# EAGLE board MaTouch ESP32-P4 TFT with Touch 7“ V1.2 (EAGLE 6.1), part 1 of 2
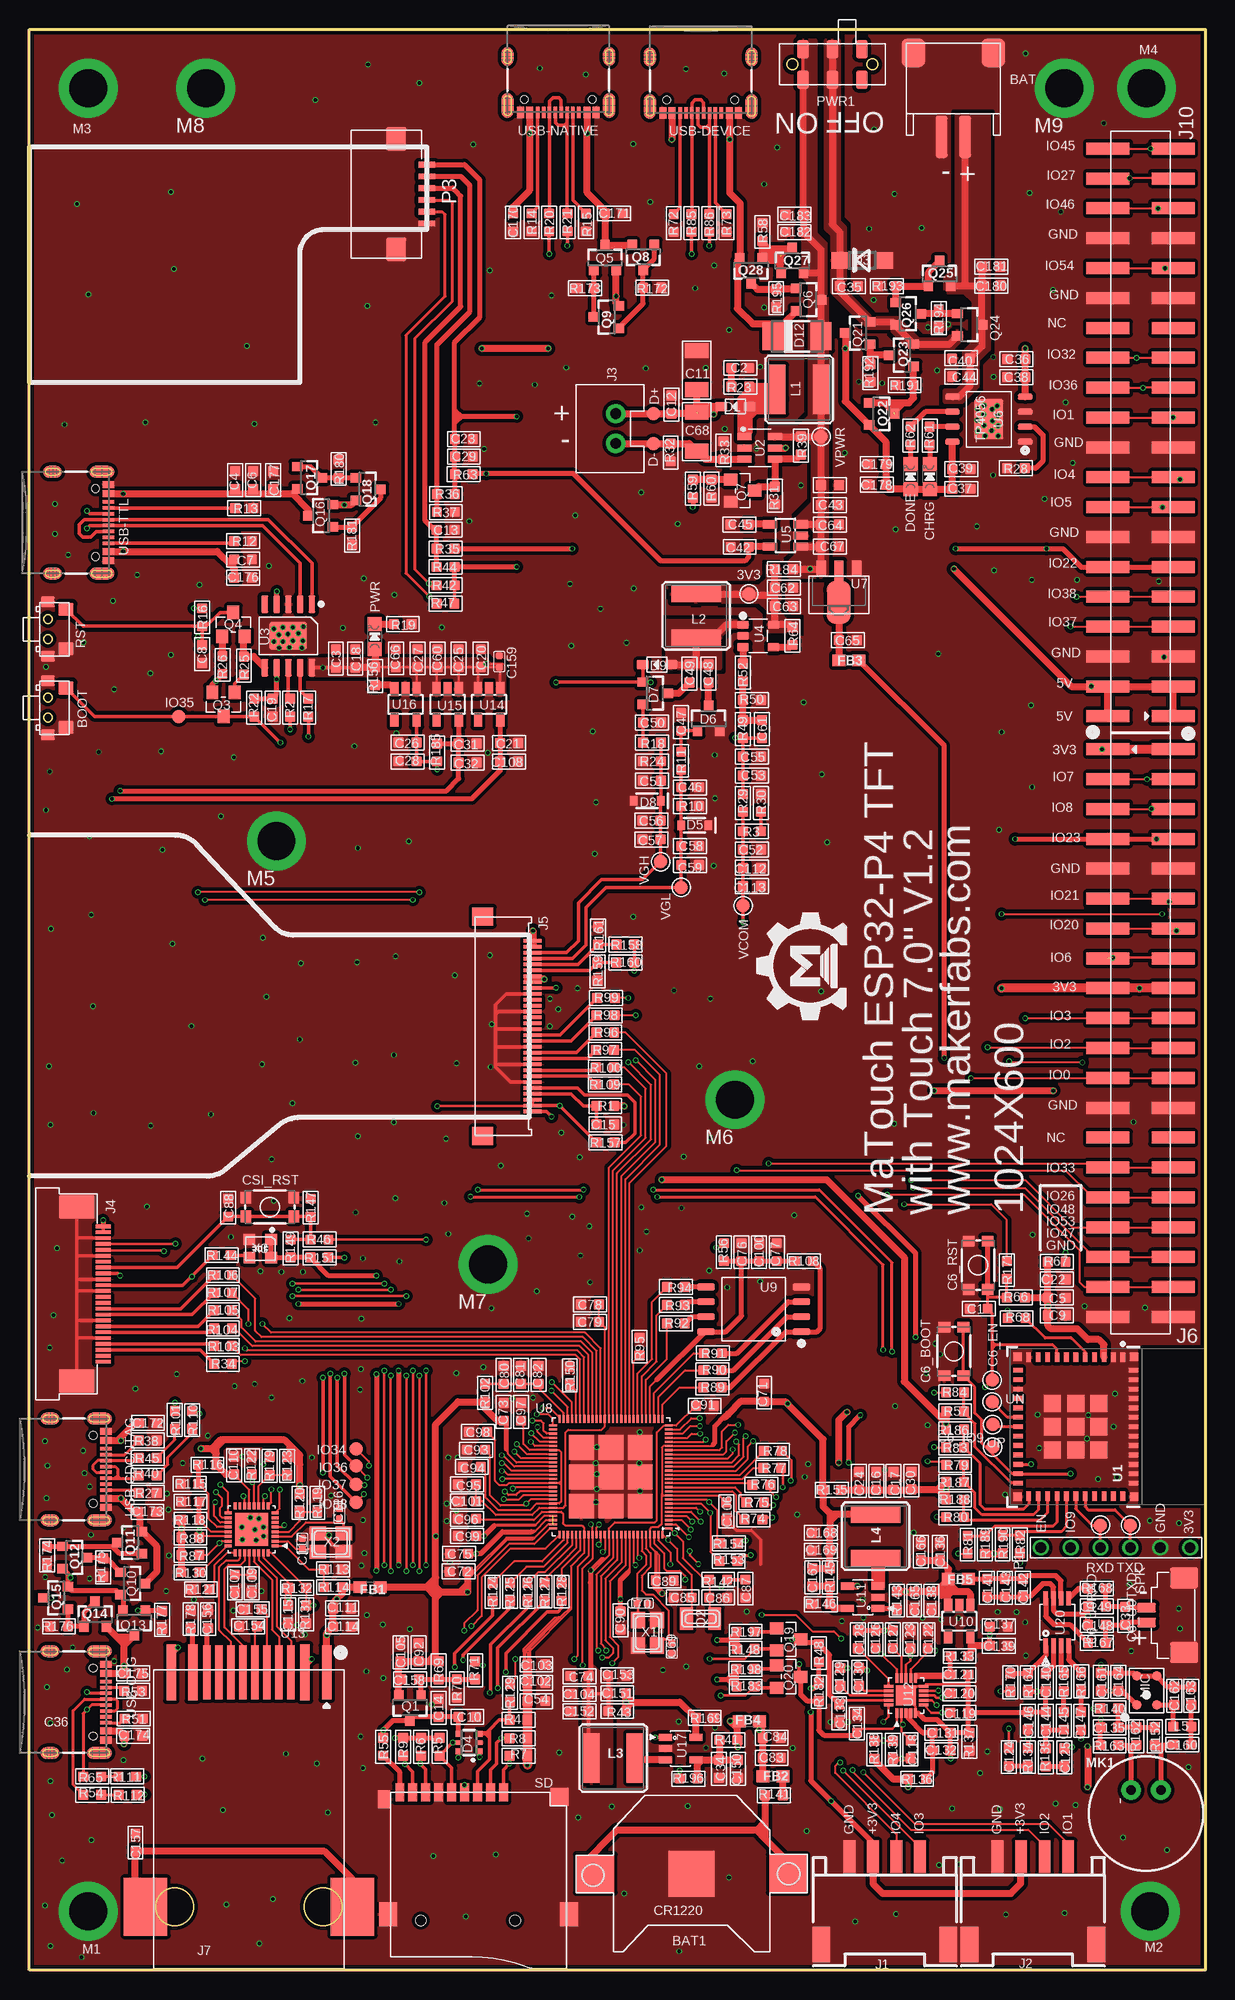
[diagram p5: board, top side]
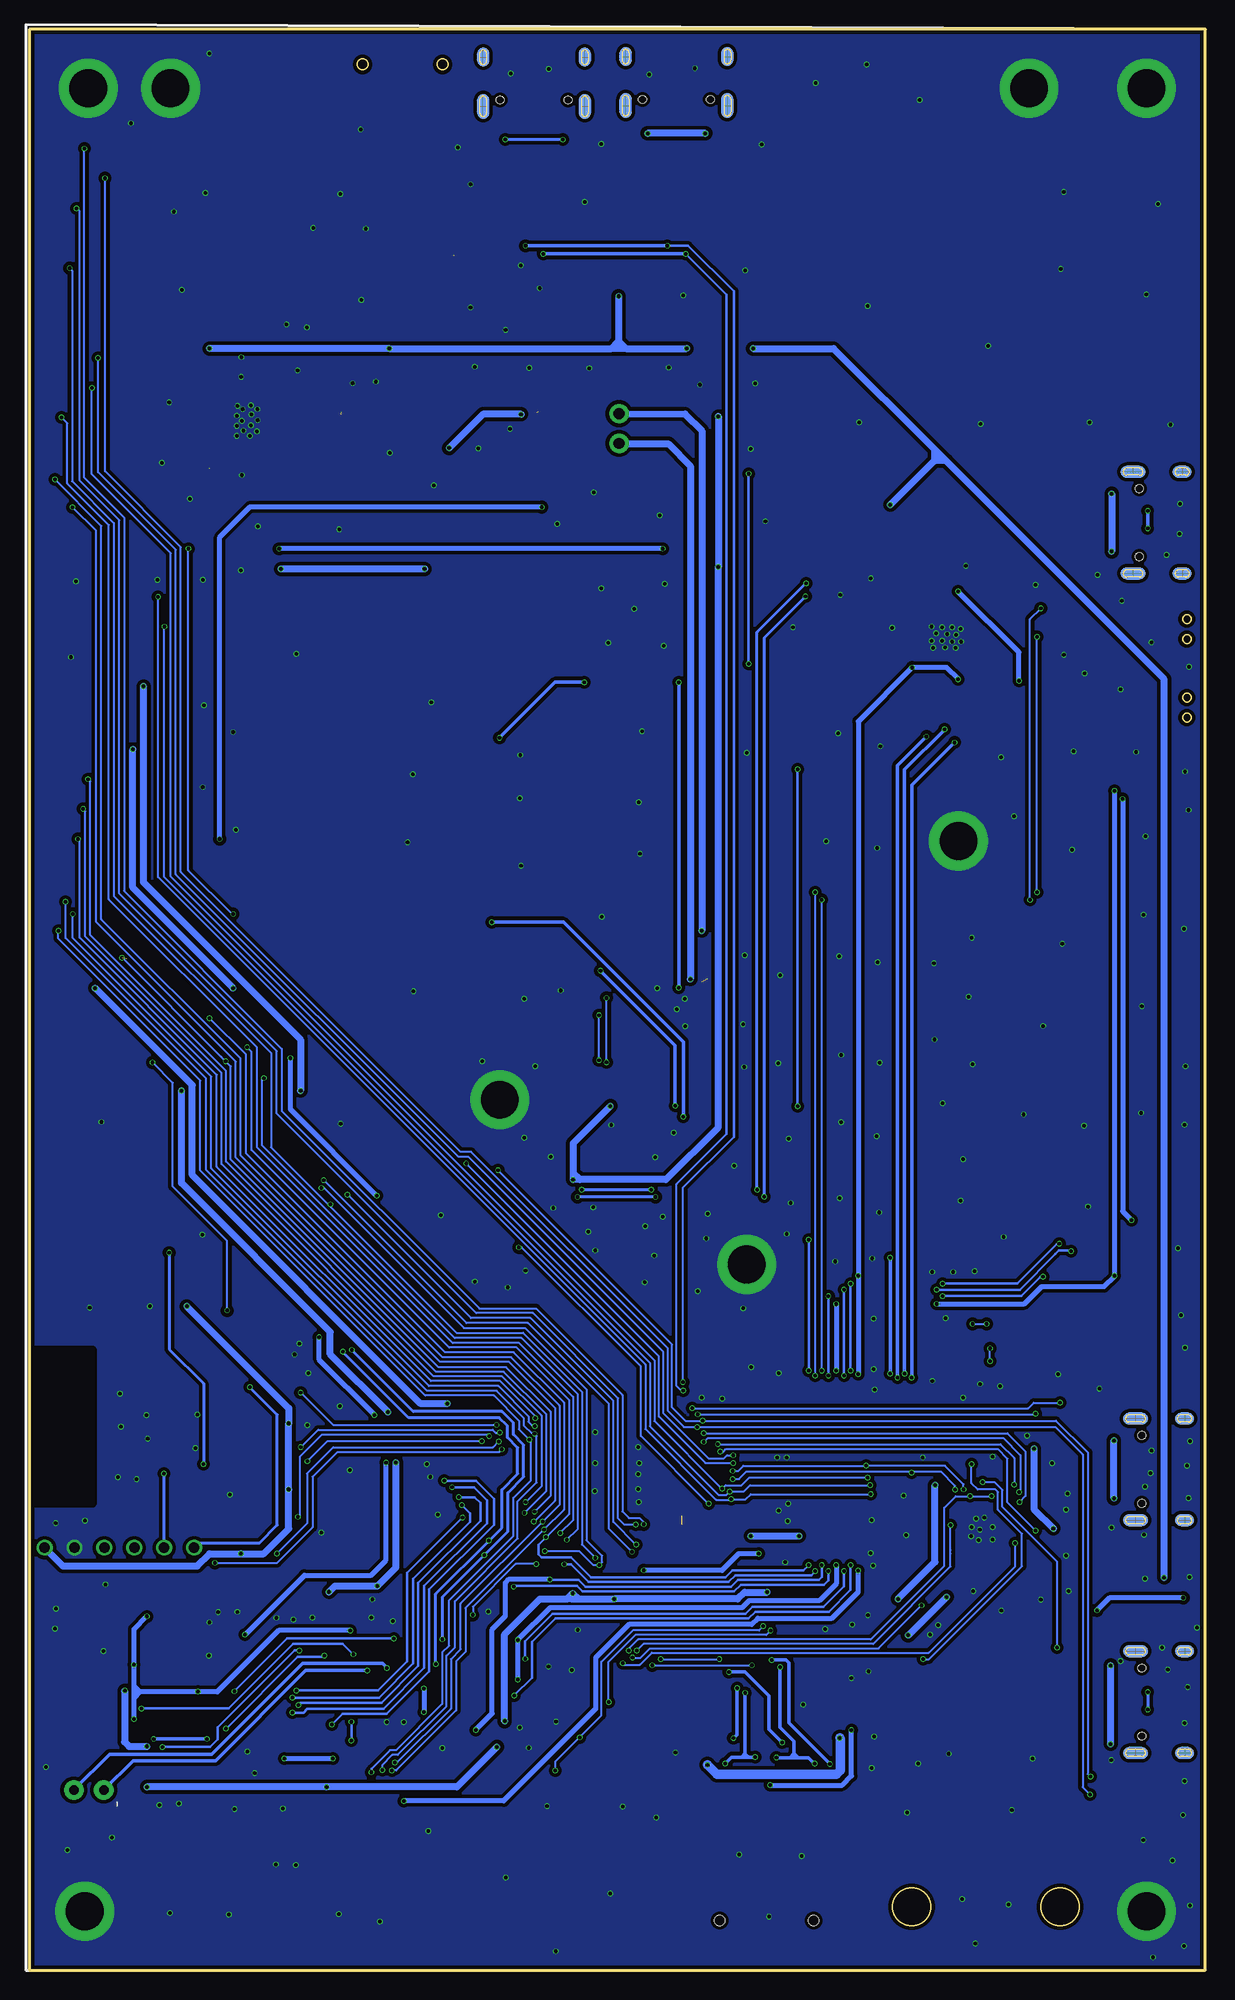
[diagram p6: board, bottom side, seen from below]

Size 100 x 165 mm. Coordinates in mm from the lower left corner, seen from the top.
Outline: 0,0 0,165 100,165 100,0 0,0
Copper layers (1*16): Top 0.035mm / dielectric 1.5mm / Bottom 0.035mm
Design rules: minimum track width 7mil, minimum drill 10mil, track to track 6mil, track to pad 6mil, pad to pad 6mil, via to via 6mil, smd to smd 0mil, copper to edge 6mil, drill to drill 6mil, minimum pad ring 3mil, minimum via ring 3mil, stop-mask expansion 2mil, vias tented up to drill 100mil, thermal gap 0mil
Net classes: 0 default: width 0.152 mm, drill 0.305 mm, clearance 0.152 mm; 1 vbat: drill 0.305 mm

## Footprints (pad centres in the part's own frame; a part is rotated, then mirrored left to right if it is on the bottom)
TP_4545 = smd 1.143 x 1.143: T 0,0
HW2-SMD-2.0-90D = smd 2 x 2.4: 3 3.4,-2.181; 4 -3.4,-2.181 | smd 1 x 3.6: + -1,4.953; - 1,4.953
CR1220-SMD = smd 3.2 x 3.2: +$1 -8.2,0; +$2 8.2,0 | smd 3.9 x 3.9: - 0,0
2*4*3.5MM = smd 1.15 x 1.3: 1 -1.675,0; 2 1.675,0 | smd 0.9 x 1.2: 3 2.3,1.55; 4 -2.3,1.55
C0603 = smd 0.889 x 0.889: 1 -0.762,0; 2 0.762,0
DISCRETE_C0603 = smd 0.889 x 0.889: 1 -0.762,0; 2 0.762,0
TACTILE_SWITCH_SMD_4.6X2.8MM = smd 0.9 x 1: 1 -2.05,-0.8; 2 2.05,-0.8; 3 2.05,0.8; 4 -2.05,0.8
DISCRETE_C1206 = smd 1.27 x 2.032: 1 -1.651,0; 2 1.651,0
DISCRETE_C0402 = smd 0.635 x 0.635: 1 -0.445,0; 2 0.445,0
C0402 = smd 0.635 x 0.635: 1 0,0.484; 2 0,-0.484
C0603' = smd 0.889 x 0.889: 1 0,0.762; 2 0,-0.762
CHIPLED_0805_NOOUTLINE = smd 1.2 x 1.2: A 0,-1.05; C 0,1.05
SOD323 = smd 1 x 0.8: + -1.2,0; - 1.2,0
SOD123 = smd 1.4 x 1.4: A 1.9,0; C -1.9,0
SOT363 = smd 0.5 x 0.5: 1 -0.75,-0.9; 3 0.75,-0.9; 4 0.75,0.9; 6 -0.75,0.9 | smd 0.4 x 0.5: 2 0,-0.9; 5 0,0.9
SOD-323 = smd 0.63 x 0.83: A 1.15,0; C -1.15,0
SOT23-3 = smd 0.8 x 0.9: 1 -0.95,-1; 2 0.95,-1; 3 0,1.1
DO-214AC = smd 1.8 x 2.4: A 2.025,0; C -2.025,0
TP-D45MIL = smd 1.143 x 1.143: T 0,0
0603 = smd 1.1 x 1: 1 -0.85,0; 2 0.85,0
HW4-SMD-2.0-90D = smd 1.01 x 2.74: 1 -3,-0.1; 2 -1,-0.1; 3 1,-0.1; 4 3,-0.1 | smd 1.5 x 3: SS1 -5.4,7.4; SS2 5.4,7.4
XH2.54-2P = drill 0.9 pad 1.651: 1 -1.27,0; 2 1.27,0
SMD26-50P-1760L450W = smd 0.3 x 1.3: 1 5.75,0; 2 5.25,0; 3 4.75,0; 4 4.25,0; 5 3.75,0; 6 3.25,0; 7 2.75,0; 8 2.25,0; 9 1.75,0; 10 1.25,0; 11 0.75,0; 12 0.25,0; 13 -0.25,0; 14 -0.75,0; 15 -1.25,0; 16 -1.75,0; 17 -2.25,0; 18 -2.75,0; 19 -3.25,0; 20 -3.75,0; 21 -4.25,0; 22 -4.75,0; 23 -5.25,0; 24 -5.75,0 | smd 2 x 3: 25 -7.4,-2.25; 26 7.4,-2.25
30P-0.5-90D-18.4X5.0 = smd 0.305 x 1.524: 1 7.25,2; 2 6.75,2; 3 6.25,2; 4 5.75,2; 5 5.25,2; 6 4.75,2; 7 4.25,2; 8 3.75,2; 9 3.25,2; 10 2.75,2; 11 2.25,2; 12 1.75,2; 13 1.25,2; 14 0.75,2; 15 0.25,2; 16 -0.25,2; 17 -0.75,2; 18 -1.25,2; 19 -1.75,2; 20 -2.25,2; 21 -2.75,2; 22 -3.25,2; 23 -3.75,2; 24 -4.25,2; 25 -4.75,2; 26 -5.25,2; 27 -5.75,2; 28 -6.25,2; 29 -6.75,2; 30 -7.25,2 | smd 1.524 x 1.778: P$1 -9.33,-2.25; P$2 9.33,-2.25
SMD2X20-254P-5080L750W920H = smd 1.02 x 3.65: 1 -24.13,-2.775; 2 -24.13,2.775; 3 -21.59,-2.775; 4 -21.59,2.775; 5 -19.05,-2.775; 6 -19.05,2.775; 7 -16.51,-2.775; 8 -16.51,2.775; 9 -13.97,-2.775; 10 -13.97,2.775; 11 -11.43,-2.775; 12 -11.43,2.775; 13 -8.89,-2.775; 14 -8.89,2.775; 15 -6.35,-2.775; 16 -6.35,2.775; 17 -3.81,-2.775; 18 -3.81,2.775; 19 -1.27,-2.775; 20 -1.27,2.775; 21 1.27,-2.775; 22 1.27,2.775; 23 3.81,-2.775; 24 3.81,2.775; 25 6.35,-2.775; 26 6.35,2.775; 27 8.89,-2.775; 28 8.89,2.775; 29 11.43,-2.775; 30 11.43,2.775; 31 13.97,-2.775; 32 13.97,2.775; 33 16.51,-2.775; 34 16.51,2.775; 35 19.05,-2.775; 36 19.05,2.775; 37 21.59,-2.775; 38 21.59,2.775; 39 24.13,-2.775; 40 24.13,2.775
HR961160C = smd 0.81 x 4.6: 1 -6.61,-9.961 | smd 0.81 x 4.77: 2 -4.77,-9.961; 11 4.77,-9.961; 12 6.61,-9.961 | smd 0.61 x 4.6: 3 -3.57,-9.961; 4 -2.55,-9.961; 5 -1.53,-9.961; 6 -0.51,-9.961; 7 0.51,-9.961; 8 1.53,-9.961; 9 2.55,-9.961; 10 3.57,-9.961 | smd 3.7 x 4.9: 13 8.799,9.961; 14 -8.799,9.961
CR54 = smd 4.2 x 1.4: P$1 0,1.85; P$2 0,-1.85
L0603 = smd 0.889 x 0.889: 1 -0.762,0; 2 0.762,0
M2.5 = drill 3.2 pad 5: 1 0,0
MIC4-SMD-3.76X2.95MM = smd 0.8 x 0.8: 1 0.85,1.23; 2 0.85,-1.23; 3 -0.85,-1.23; 4 -0.85,1.23
MICROPHONE-PTH-9.7MM = drill 0.8 pad 1.676: 1 -2,1.27; 2 -2,-1.27
DEBUG*6 = drill 0.9: 1 0,0; 2 0,2.54; 3 0,5.08; 4 0,7.62; 5 0,10.16; 6 0,12.7
1*6P-SMT1MM = smd 0.5 x 1.5: 1 -2.5,0; 2 -1.5,0; 3 -0.5,0; 4 0.5,0; 5 1.5,0; 6 2.5,0 | smd 2 x 1.7: 7 4.7,-2.6; 8 -4.7,-2.6
SMD-6-2.5MM = smd 1 x 1.6: 1 -2.5,1.3; 1@1 -2.5,-1.3; 2 0,1.3; 2@1 0,-1.3; 3 2.5,1.3; 3@1 2.5,-1.3
XTAL3215 = smd 1.1 x 1.9: P$1 1.2,0; P$2 -1.2,0
SOT23 = smd 1.016 x 1.143: 1 -0.95,-1.016; 2 0.95,-1.016; 3 0,1.016
DISCRETE_R0603 = smd 0.889 x 0.889: 1 -0.762,0; 2 0.762,0
R0603 = smd 0.889 x 0.889: 1 -0.762,0; 2 0.762,0
9P-SMD-W/-RING = smd 1.524 x 0.762: 1 0,4.4; 2 0,3.3; 3 0,2.2; 4 0,1.1; 5 0,0; 6 0,-1.1; 7 0,-2.2; 8 0,-3.3; 9 0,-4.4 | smd 1.524 x 1.016: G1 0.6,-5.746 | smd 2.032 x 1.524: G2 10.373,-5.4; G3 10.373,10 | smd 1.524 x 1.524: G4 0.392,9.181 | hole 0.889: 10.9,-2.6; 10.9,5.4
1X2P-SMT1.25MM = smd 0.8 x 1.6: 1 -0.625,0; 2 0.625,0 | smd 1.8 x 2.4: 3 3.175,-3.2; 4 -3.175,-3.2
ESP32-C6-MINI-1 = smd 0.8 x 0.4: 1 -5.9,4; 2 -5.9,3.2; 3 -5.9,2.4; 4 -5.9,1.6; 5 -5.9,0.8; 6 -5.9,0; 7 -5.9,-0.8; 8 -5.9,-1.6; 9 -5.9,-2.4; 10 -5.9,-3.2; 11 -5.9,-4; 25 5.9,-4; 26 5.9,-3.2; 27 5.9,-2.4; 28 5.9,-1.6; 29 5.9,-0.8; 30 5.9,0; 31 5.9,0.8; 32 5.9,1.6; 33 5.9,2.4; 34 5.9,3.2; 35 5.9,4 | smd 0.4 x 0.8: 12 -4.8,-4.9; 13 -4,-4.9; 14 -3.2,-4.9; 15 -2.4,-4.9; 16 -1.6,-4.9; 17 -0.8,-4.9; 18 0,-4.9; 19 0.8,-4.9; 20 1.6,-4.9; 21 2.4,-4.9; 22 3.2,-4.9; 23 4,-4.9; 24 4.8,-4.9; 36 4.8,4.9; 37 4,4.9; 38 3.2,4.9; 39 2.4,4.9; 40 1.6,4.9; 41 0.8,4.9; 42 0,4.9; 43 -0.8,4.9; 44 -1.6,4.9; 45 -2.4,4.9; 46 -3.2,4.9; 47 -4,4.9; 48 -4.8,4.9 | smd 1.45 x 1.45: 49.1 -1.975,1.975; 49.2 -1.975,0; 49.3 -1.975,-1.975; 49.4 0,-1.975; 49.5 1.975,-1.975; 49.6 1.975,0; 49.7 1.975,1.975; 49.8 0,1.975; 49.9 0,0 | smd 0.7 x 0.7: 50 5.95,4.95; 51 5.95,-4.95; 52 -5.95,-4.95; 53 -5.95,4.95
SOT23-6 = smd 1.2 x 0.6: 1 -1.3,0.95; 2 -1.3,0; 3 -1.3,-0.95; 4 1.3,-0.95; 5 1.3,0; 6 1.3,0.95
ESOP-10-EP-150MIL = smd 1.5 x 0.6: 1 -2.7,2; 2 -2.7,1; 3 -2.7,0; 4 -2.7,-1; 5 -2.7,-2; 6 2.7,-2; 7 2.7,-1; 8 2.7,0; 9 2.7,1; 10 2.7,2 | smd 2.4 x 3.2: EP 0,0
SOT-23-5 = smd 0.7 x 1: 1 -0.95,-1.3; 2 0,-1.3; 3 0.95,-1.3; 4 0.95,1.3; 5 -0.95,1.3
SOT23-5 = smd 0.69 x 1.2: 1 -0.95,-1.3; 2 0,-1.3; 3 0.95,-1.3; 4 0.95,1.3; 5 -0.95,1.3
SOP8-1.27P = smd 1.27 x 0.51: 1 -3.1,1.905; 2 -3.1,0.635; 3 -3.1,-0.635; 4 -3.1,-1.905; 5 3.1,-1.905; 6 3.1,-0.635; 7 3.1,0.635; 8 3.1,1.905 | smd 2.5 x 3.4: 9 0,0
SOT89 = smd 0.8 x 1.4: 1 -1.524,-1.905; 3 1.524,-1.905 | smd 0.8 x 1.9: 2 0,-1.651 | smd 2.032 x 3.65: 4 0,0.94
QFN105-35P-500L500W = smd 0.65 x 0.18: 1 -4.925,4.375; 2 -4.925,4.025; 3 -4.925,3.675; 4 -4.925,3.325; 5 -4.925,2.975; 6 -4.925,2.625; 7 -4.925,2.275; 8 -4.925,1.925; 9 -4.925,1.575; 10 -4.925,1.225; 11 -4.925,0.875; 12 -4.925,0.525; 13 -4.925,0.175; 14 -4.925,-0.175; 15 -4.925,-0.525; 16 -4.925,-0.875; 17 -4.925,-1.225; 18 -4.925,-1.575; 19 -4.925,-1.925; 20 -4.925,-2.275; 21 -4.925,-2.625; 22 -4.925,-2.975; 23 -4.925,-3.325; 24 -4.925,-3.675; 25 -4.925,-4.025; 26 -4.925,-4.375; 53 4.925,-4.375; 54 4.925,-4.025; 55 4.925,-3.675; 56 4.925,-3.325; 57 4.925,-2.975; 58 4.925,-2.625; 59 4.925,-2.275; 60 4.925,-1.925; 61 4.925,-1.575; 62 4.925,-1.225; 63 4.925,-0.875; 64 4.925,-0.525; 65 4.925,-0.175; 66 4.925,0.175; 67 4.925,0.525; 68 4.925,0.875; 69 4.925,1.225; 70 4.925,1.575; 71 4.925,1.925; 72 4.925,2.275; 73 4.925,2.625; 74 4.925,2.975; 75 4.925,3.325; 76 4.925,3.675; 77 4.925,4.025; 78 4.925,4.375 | smd 0.18 x 0.65: 27 -4.375,-4.925; 28 -4.025,-4.925; 29 -3.675,-4.925; 30 -3.325,-4.925; 31 -2.975,-4.925; 32 -2.625,-4.925; 33 -2.275,-4.925; 34 -1.925,-4.925; 35 -1.575,-4.925; 36 -1.225,-4.925; 37 -0.875,-4.925; 38 -0.525,-4.925; 39 -0.175,-4.925; 40 0.175,-4.925; 41 0.525,-4.925; 42 0.875,-4.925; 43 1.225,-4.925; 44 1.575,-4.925; 45 1.925,-4.925; 46 2.275,-4.925; 47 2.625,-4.925; 48 2.975,-4.925; 49 3.325,-4.925; 50 3.675,-4.925; 51 4.025,-4.925; 52 4.375,-4.925; 79 4.375,4.925; 80 4.025,4.925; 81 3.675,4.925; 82 3.325,4.925; 83 2.975,4.925; 84 2.625,4.925; 85 2.275,4.925; 86 1.925,4.925; 87 1.575,4.925; 88 1.225,4.925; 89 0.875,4.925; 90 0.525,4.925; 91 0.175,4.925; 92 -0.175,4.925; 93 -0.525,4.925; 94 -0.875,4.925; 95 -1.225,4.925; 96 -1.575,4.925; 97 -1.925,4.925; 98 -2.275,4.925; 99 -2.625,4.925; 100 -2.975,4.925; 101 -3.325,4.925; 102 -3.675,4.925; 103 -4.025,4.925; 104 -4.375,4.925 | smd 2.1 x 2.1: 105 0,0; 106 -2.5,0; 107 2.5,0; 108 2.5,2.5; 109 0,2.5; 110 -2.5,2.5; 111 -2.5,-2.5; 112 0,-2.5; 113 2.5,-2.5
SOIC-8-208MIL = smd 1.5 x 0.635: 1 -4.05,1.905; 2 -4.05,0.635; 3 -4.05,-0.635; 4 -4.05,-1.905; 5 4.05,-1.905; 6 4.05,-0.635; 7 4.05,0.635; 8 4.05,1.905
SOT23-5-95P-300L300W = smd 1.1 x 0.6: 1 -1.3,0.95; 2 -1.3,0; 3 -1.3,-0.95; 4 1.3,-0.95; 5 1.3,0.95
QFN20-40P-300L300W55H = smd 0.8 x 0.25: 1 -1.5,0.8; 2 -1.5,0.4; 3 -1.5,0; 4 -1.5,-0.4; 5 -1.5,-0.8; 11 1.5,-0.8; 12 1.5,-0.4; 13 1.5,0; 14 1.5,0.4; 15 1.5,0.8 | smd 0.25 x 0.8: 6 -0.8,-1.5; 7 -0.4,-1.5; 8 0,-1.5; 9 0.4,-1.5; 10 0.8,-1.5; 16 0.8,1.5; 17 0.4,1.5; 18 0,1.5; 19 -0.4,1.5; 20 -0.8,1.5 | smd 1.7 x 1.7: 21 0,0
QFN32-40P-400W400L = smd 0.6 x 0.25: 1 -2,1.4; 2 -2,1; 3 -2,0.6; 4 -2,0.2; 5 -2,-0.2; 6 -2,-0.6; 7 -2,-1; 8 -2,-1.4; 17 2,-1.4; 18 2,-1; 19 2,-0.6; 20 2,-0.2; 21 2,0.2; 22 2,0.6; 23 2,1; 24 2,1.4 | smd 0.25 x 0.6: 9 -1.4,-2; 10 -1,-2; 11 -0.6,-2; 12 -0.2,-2; 13 0.2,-2; 14 0.6,-2; 15 1,-2; 16 1.4,-2; 25 1.4,2; 26 1,2; 27 0.6,2; 28 0.2,2; 29 -0.2,2; 30 -0.6,2; 31 -1,2; 32 -1.4,2 | smd 2.8 x 2.8: 33 0,0
MSOP8-65P-490L300W110H = smd 1.2 x 0.38: 1 -2,0.975; 2 -2,0.325; 3 -2,-0.325; 4 -2,-0.975; 5 2,-0.975; 6 2,-0.325; 7 2,0.325; 8 2,0.975
USB-C-16P-5 = smd 0.3 x 1: A5 -1.25,-0.34; A6 -0.25,-0.34; A7 0.25,-0.34; A8 1.25,-0.34; B5 1.75,-0.34; B6 0.75,-0.34; B7 -0.75,-0.34; B8 -1.75,-0.34 | smd 0.6 x 1: GND -3.225,-0.34; GND2 3.225,-0.34; VBUS1 -2.45,-0.34; VBUS2 2.45,-0.34 | smd 1 x 2.1: SHLD1 -4.32,-0.915; SHLD2 4.32,-0.915 | smd 1 x 2.1 bottom: SHLD3 -4.32,-0.915; SHLD4 4.32,-0.915 | smd 1 x 1.6: SHLD5 -4.32,-5.095; SHLD8 4.32,-5.095 | smd 1 x 1.6 bottom: SHLD6 -4.32,-5.095; SHLD7 4.32,-5.095 | hole 0.65: -2.89,-1.445; 2.89,-1.445
NX3225 = smd 1.4 x 1.2: 1 -1.1,-0.8; 2 1.1,-0.8; 3 1.1,0.8; 4 -1.1,0.8
OSC4-SMD-2.5X2.0X0.8MM = smd 1 x 0.95: 1 -0.925,-0.775; 2 0.925,-0.775; 3 0.925,0.775; 4 -0.925,0.775

## Placement (x,y rotation side)
3V3  [TP_4545]  61.19,116.99 0 top
BAT  JST-2P  [HW2-SMD-2.0-90D]  78.56,160.82 180 top
BAT1  [CR1220-SMD]  56.31,8.2 180 top
BOOT  TS24CA  [2*4*3.5MM]  3.12,107.33 90 top
C1  1uF/16V  [C0603]  80.72,56.24 180 top
C2  10pF/50V  [DISCRETE_C0603]  60.45,136.22 180 top
C3  10uF  [DISCRETE_C0603]  26.06,111.51 270 top
C4  10uF  [DISCRETE_C0603]  17.5,126.67 270 top
C5  10uF  [C0603]  87.38,57.18 0 top
C6  10uF  [DISCRETE_C0603]  19.02,126.67 270 top
C6_BOOT  MOMENTARY-SWITCH-SPST-SMD-4.6X2.8MM  [TACTILE_SWITCH_SMD_4.6X2.8MM]  78.61,52.6 270 top
C6_EN  [TP_4545]  81.86,50.16 270 top
C6_IO9  [TP_4545]  81.92,44.48 270 top
C6_RST  MOMENTARY-SWITCH-SPST-SMD-4.6X2.8MM  [TACTILE_SWITCH_SMD_4.6X2.8MM]  80.67,59.92 270 top
C6_U0RXD  [TP_4545]  91.08,37.82 270 top
C6_U0TXD  [TP_4545]  93.62,37.82 270 top
C7  0.1uF  [DISCRETE_C0603]  18.16,119.94 180 top
C8  0.1uF  [DISCRETE_C0603]  14.68,111.89 90 top
C9  0.1uF  [C0603]  87.38,55.65 0 top
C10  10uF  [DISCRETE_C0603]  37.24,21.54 180 top
C11  4.7uF/35V  [DISCRETE_C1206]  56.74,136.02 270 top
C12  0.1uF/50V  [DISCRETE_C0603]  54.58,133.1 270 top
C13  NC  [DISCRETE_C0603]  35.38,122.45 180 top
C14  0.1uF  [DISCRETE_C0603]  34.8,22.3 270 top
C15  100nF  [DISCRETE_C0603]  48.97,71.91 180 top
C16  10uF  [DISCRETE_C0603]  72.01,41.61 270 top
C17  0.1uF  [DISCRETE_C0603]  73.48,41.61 270 top
C18  0.1uF  [DISCRETE_C0603]  27.71,111.51 270 top
C19  0.1uF  [DISCRETE_C0603]  20.68,107.34 90 top
C20  4.7uF/16V  [C0603]  38.38,111.53 90 top
C21  10uF  [C0603]  40.79,104.32 0 top
C22  10uF  [C0603]  87.37,58.71 0 top
C23  10uF  [DISCRETE_C0603]  36.94,130.16 180 top
C24  0.1uF  [DISCRETE_C0603]  70.53,41.61 270 top
C25  4.7uF/16V  [C0603]  36.5,111.53 90 top
C26  0.1uF  [DISCRETE_C0603]  32.16,104.37 0 top
C27  4.7uF/16V  [C0603]  32.99,111.53 90 top
C28  10uF  [C0603]  32.16,102.77 180 top
C29  10uF  [DISCRETE_C0603]  36.94,128.67 180 top
C30  0.1uF  [DISCRETE_C0603]  74.98,41.62 270 top
C31  10uF  [C0603]  37.26,104.29 0 top
C32  0.1uF  [DISCRETE_C0603]  37.26,102.67 180 top
C33  330pF/50V  [C0603]  93.19,30.12 90 top
C34  10uF  [C0603]  58.65,17.12 270 top
C35  10uF  [C0603]  69.7,143.18 180 top
C36  10uF  [C0603]  83.92,136.96 0 top
C37  0.1uF  [C0603]  79.25,125.93 0 top
C38  10uF  [C0603]  83.92,135.43 180 top
C39  0.1uF  [C0603]  79.25,127.61 0 top
C40  10uF  [C0603]  79.22,137.03 180 top
C41  4.7uF/16V  [C0603]  68.07,126.26 0 top
C42  10uF  [C0603]  60.4,121.01 180 top
C43  10uF  [C0603]  68.07,124.56 180 top
C44  0.1uF  [C0603]  79.22,135.48 180 top
C45  NC  [C0603]  60.38,122.91 180 top
C46  0.1uF  [DISCRETE_C0603]  56.18,100.56 180 top
C47  0.1uF  [DISCRETE_C0603]  55.42,106.12 270 top
C48  0.1uF  [DISCRETE_C0603]  57.76,110.24 270 top
C49  0.1uF  [DISCRETE_C0603]  56.13,110.24 90 top
C50  0.1uF  [DISCRETE_C0603]  52.93,106.07 180 top
C51  0.1uF  [DISCRETE_C0603]  52.93,101.14 0 top
C52  0.1uF  [DISCRETE_C0603]  61.44,95.28 180 top
C53  0.1uF  [DISCRETE_C0603]  61.44,101.57 180 top
C54  10uF  [DISCRETE_C0603]  43.11,22.87 180 top
C55  0.1uF  [DISCRETE_C0603]  61.44,103.17 180 top
C56  1uF  [DISCRETE_C0603]  52.91,97.74 0 top
C57  1uF  [DISCRETE_C0603]  52.91,96.14 0 top
C58  1uF  [DISCRETE_C0603]  56.18,95.58 180 top
C59  1uF  [DISCRETE_C0603]  56.18,93.95 180 top
C60  0.1uF  [DISCRETE_C0603]  34.7,111.53 270 top
C61  10pF/25V  [DISCRETE_C0603]  62.28,105.51 270 top
C62  0.1uF  [DISCRETE_C0603]  64.16,117.55 180 top
C63  10uF  [DISCRETE_C0603]  64.16,115.98 180 top
C64  4.7uF/16V  [C0603]  68.07,122.91 0 top
C65  10uF  [C0603]  69.6,113.08 0 top
C66  0.1uF  [DISCRETE_C0603]  31.17,111.53 270 top
C67  0.1uF  [C0603]  68.07,121.03 180 top
C68  NC  [DISCRETE_C1206]  56.74,130.81 90 top
C69  12pF  [DISCRETE_C0402]  54.64,27.38 270 top
C70  12pF  [DISCRETE_C0402]  52.12,31.19 180 top
C71  10uF  [C0603]  62.48,49.1 90 top
C72  0.1uF  [C0603]  36.5,33.88 180 top
C73  0.1uF  [C0603]  40.34,47.47 90 top
C74  10uF  [C0603]  46.79,24.99 180 top
C75  0.1uF  [C0603]  36.53,35.41 180 top
C76  10uF  [C0603]  60.55,61.04 90 top
C77  0.1uF  [C0603]  63.55,61.04 90 top
C78  10uF  [C0603]  47.68,56.59 180 top
C79  0.1uF  [C0603]  47.68,55.12 180 top
C80  10uF  [C0603]  40.31,50.6 90 top
C81  0.1uF  [C0603]  41.81,50.6 90 top
C82  10nF  [C0603]  43.31,50.6 90 top
C83  10uF  [C0603]  63.12,18.06 0 top
C84  0.1uF  [C0603]  63.12,19.74 0 top
C85  20pF  [DISCRETE_C0603]  55.55,31.67 180 top
C86  20pF  [DISCRETE_C0603]  58.57,31.67 0 top
C87  15pF  [DISCRETE_C0603]  60.88,32.44 90 top
C88  15pF  [DISCRETE_C0603]  16.89,64.82 270 top
C89  10uF  [C0603]  54.03,33.12 0 top
C90  0.1uF  [C0603]  50.27,29.74 270 top
C91  0.1uF  [C0603]  57.43,47.98 0 top
C92  0.1uF  [C0603]  33.1,27.03 90 top
C93  1uF/16V  [C0603]  37.97,44.25 180 top
C94  1uF/16V  [C0603]  37.62,42.77 180 top
C95  1uF/16V  [C0603]  37.21,41.3 180 top
C96  1uF/16V  [C0603]  37.21,38.38 180 top
C97  10uF  [C0603]  41.81,47.47 90 top
C98  0.1uF  [C0603]  38.15,45.75 180 top
C99  0.1uF  [C0603]  37.21,36.91 180 top
C100  0.1uF  [C0603]  62.05,61.04 90 top
C101  1uF  [C0603]  37.21,39.85 180 top
C102  10uF  [C0603]  43.1,24.43 0 top
C103  0.1uF  [C0603]  43.1,26.01 0 top
C104  0.1uF  [C0603]  46.79,23.5 180 top
C105  0.1uF  [C0603]  31.55,27.03 90 top
C106  0.1uF  [C0603]  59.26,38.99 270 top
C107  10uF  [C0603]  17.48,32.87 270 top
C108  0.1uF  [DISCRETE_C0603]  40.79,102.74 180 top
C109  0.1uF  [C0603]  18.9,32.87 270 top
C110  10uF  [C0603]  17.4,42.9 90 top
C111  0.1uF  [C0603]  26.59,30.76 0 top
C112  0.1uF  [DISCRETE_C0603]  61.44,93.73 180 top
C113  10uF  [DISCRETE_C0603]  61.44,92.18 180 top
C114  10uF  [C0603]  26.59,29.21 0 top
C115  0.1uF  [C0603]  22,30.25 270 top
C116  12pF  [DISCRETE_C0402]  26.37,38.81 90 top
C117  12pF  [DISCRETE_C0402]  23.22,36.27 270 top
C118  22pF  [C0603]  74.93,18.77 270 top
C119  22pF  [C0603]  79.07,21.89 0 top
C120  22pF  [C0603]  79.07,23.52 0 top
C121  1uF/16V  [C0603]  79.07,25.12 0 top
C122  22pF  [C0603]  76.38,28.12 90 top
C123  22pF  [C0603]  74.93,28.12 90 top
C124  1uF/16V  [C0603]  83.29,18.11 270 top
C125  1uF/16V  [C0603]  88.01,18.08 270 top
C126  1uF/16V  [C0603]  71.96,28.12 270 top
C127  1uF/16V  [C0603]  73.43,28.12 270 top
C128  1uF/16V  [C0603]  70.46,28.12 90 top
C129  1uF/16V  [C0603]  68.96,24.92 90 top
C130  1uF/16V  [C0603]  70.56,24.94 90 top
C131  0.1uF  [C0603]  77.55,20.17 0 top
C132  0.1uF  [C0603]  77.55,18.67 0 top
C133  22pF  [C0603]  68.86,21.82 270 top
C134  22pF  [C0603]  70.38,20.95 90 top
C135  1uF/16V  [C0603]  91.85,20.65 180 top
C136  4.7uF/16V  [C0603]  77.42,35.59 90 top
C137  10uF  [C0603]  82.42,29.21 0 top
C138  0.1uF  [C0603]  76.71,31.42 90 top
C139  0.1uF  [C0603]  82.42,27.58 180 top
C140  1uF/16V  [C0603]  86.44,24.46 270 top
C141  1uF/16V  [C0603]  81.43,32.51 270 top
C142  10uF  [C0603]  84.48,32.51 270 top
C143  0.1uF  [C0603]  82.96,32.51 270 top
C144  22pF  [C0603]  86.44,21.21 90 top
C145  0.1uF  [C0603]  87.96,21.21 90 top
C146  22pF  [C0603]  84.91,21.21 90 top
C147  0.1uF  [C0603]  89.43,21.18 90 top
C148  330pF/50V  [C0603]  90.78,29.36 180 top
C149  330pF/50V  [C0603]  90.78,30.91 0 top
C150  0.1uF  [C0603]  60.25,17.12 90 top
C151  22pF  [C0603]  49.99,23.55 0 top
C152  10uF  [C0603]  46.79,22 180 top
C153  0.1uF  [C0603]  49.99,25.04 180 top
C154  0.1uF  [C0603]  18.59,29.24 180 top
C155  0.1uF  [C0603]  19,30.68 180 top
C156  1nF/50V  [C0603]  15.21,29.84 90 top
C157  1nF/50V  [C0603]  9.02,10.85 90 top
C158  0.1uF  [DISCRETE_C0603]  32.38,24.71 180 top
C159  100nF  [C0402]  39.95,111.25 0 top
C160  10uF  [C0603']  98.04,19.18 270 top
C161  10uF  [C0603']  91.11,24.51 0 top
C162  33pF  [C0603']  97.36,23.32 180 top
C163  33pF  [C0603']  98.81,23.32 180 top
C164  100nF  [C0603']  92.61,24.51 180 top
C165  10uF  [C0603]  75.23,31.42 270 top
C166  0.1uF  [C0603]  75.79,35.59 270 top
C167  22pF  [C0603]  66.57,33.4 270 top
C168  10uF  [C0603]  67.31,37.19 180 top
C169  0.1uF  [C0603]  67.31,35.66 0 top
C170  10uF  [C0603]  41.12,148.59 270 top
C171  0.1uF  [C0603]  49.71,149.35 0 top
C172  10uF  [C0603]  10.08,46.51 0 top
C173  0.1uF  [C0603]  10.03,38.96 0 top
C174  10uF  [C0603]  8.84,19.91 0 top
C175  0.1uF  [C0603]  8.81,25.22 0 top
C176  10uF  [C0603]  18.16,118.39 0 top
C177  0.1uF  [C0603]  20.73,126.67 90 top
C178  10uF  [C0603]  72.06,126.29 180 top
C179  0.1uF  [C0603]  72.06,128.04 180 top
C180  10uF  [C0603]  81.79,143.21 0 top
C181  0.1uF  [C0603]  81.79,144.83 0 top
C182  10uF  [C0603]  65.05,147.78 180 top
C183  0.1uF  [C0603]  65.05,149.25 180 top
CHRG  CHRG  [CHIPLED_0805_NOOUTLINE]  76.56,126.97 0 top
CSI_RST  MOMENTARY-SWITCH-SPST-SMD-4.6X2.8MM  [TACTILE_SWITCH_SMD_4.6X2.8MM]  20.45,64.87 180 top
D1  1N4148WS  [SOD323]  60.02,132.94 180 top
D3  W8/5.1V  [SOD123]  70.82,145.36 0 top
D4  SMF05C  [SOT363]  37.39,19.35 90 top
D5  7.5V  [SOD-323]  56.57,97.33 180 top
D6  200mA/70V  [SOT23-3]  57.76,106.38 0 top
D7  200mA/70V  [SOT23-3]  53.16,108.56 270 top
D8  20V  [SOD-323]  52.53,99.42 180 top
D9  1N4148WS  [SOD323]  53.37,111 180 top
D12  SS54  [DO-214AC]  65.28,138.91 0 top
D+  [TP-D45MIL]  53.06,132.33 270 top
D-  [TP-D45MIL]  53.06,129.79 270 top
DONE  GREEN  [CHIPLED_0805_NOOUTLINE]  74.93,126.97 0 top
FB1  [0603]  28.98,32.56 0 top
FB2  [0603]  63.22,16.48 180 top
FB3  [0603]  69.7,111.35 0 top
FB4  [0603]  61.21,21.16 0 top
FB5  [0603]  78.99,33.27 180 top
IO34  [TP-D45MIL]  27.79,44.32 90 top
IO35  [TP-D45MIL]  12.7,106.58 270 top
IO36  [TP-D45MIL]  27.76,42.85 90 top
IO37  [TP-D45MIL]  27.76,41.3 90 top
IO38  [TP-D45MIL]  27.76,39.78 90 top
J1  [HW4-SMD-2.0-90D]  72.73,9.56 180 top
J2  [HW4-SMD-2.0-90D]  85.32,9.56 180 top
J3  XH2.54-2P  [XH2.54-2P]  49.86,131.06 270 top
J4  [SMD26-50P-1760L450W]  6.27,57.48 270 top
J5  [30P-0.5-90D-18.4X5.0]  40.8,80.25 270 top
J6  [SMD2X20-254P-5080L750W920H]  94.49,79.67 270 top
J7  [HR961160C]  18.67,15.34 180 top
J10  [SMD2X20-254P-5080L750W920H]  94.49,130.73 90 top
L1  10µH/±30%  [CR54]  65.46,134.39 270 top
L2  10µH/±30%  [CR54]  56.69,115.14 0 top
L3  2.2µH/±30%/3.4A  [CR54]  49.63,18.03 270 top
L4  2.2µH/±30%/3.4A  [CR54]  71.96,36.88 180 top
L5  BLM18BD252SN1  [L0603]  98.04,20.7 0 top
M1  M2.5  [M2.5]  5,5 0 top
M2  M2.5  [M2.5]  95.3,5 0 top
M3  M2.5  [M2.5]  5,160 0 top
M4  M2.5  [M2.5]  95,160 0 top
M5  M2.5  [M2.5]  21,96 0 top
M6  M2.5  [M2.5]  60,74 0 top
M7  M2.5  [M2.5]  39,60 0 top
M8  M2.5  [M2.5]  15,160 0 top
M9  M2.5  [M2.5]  88,160 0 top
MIC  SAO-3729-M-42-008  [MIC4-SMD-3.76X2.95MM]  95,23.77 180 top
MK1  MIC-PTH  [MICROPHONE-PTH-9.7MM]  94.95,13.31 270 top
P1  DEBUG6  [DEBUG*6]  98.7,35.92 90 top
P3  1X6P-1MM  [1*6P-SMT1MM]  33.8,151 270 top
PWR  GREEN  [CHIPLED_0805_NOOUTLINE]  29.37,113.38 0 top
PWR1  JS102011JAQN  [SMD-6-2.5MM]  68.28,162.03 180 top
Q1  MOSFET-PCHANNEL  [SOT23-3]  32.36,22.33 180 top
Q2  32.768K  [XTAL3215]  57.07,29.87 180 top
Q3  S8050  [SOT23]  16.51,107.61 180 top
Q4  S8050  [SOT23]  17.34,114.41 0 top
Q5  MOSFET-PCHANNEL  [SOT23-3]  48.95,145.57 0 top
Q6  MOSFET-PCHANNEL  [SOT23-3]  66.22,142.01 270 top
Q7  S8050  [SOT23]  60.66,125.78 270 top
Q8  600mA/40V  [SOT23-3]  52.2,145.67 180 top
Q9  600mA/40V  [SOT23-3]  49.1,140.54 90 top
Q10  MOSFET-PCHANNEL  [SOT23-3]  8.74,32.87 270 top
Q11  600mA/40V  [SOT23-3]  8.59,36.35 90 top
Q12  600mA/40V  [SOT23-3]  3.81,35.08 270 top
Q13  MOSFET-PCHANNEL  [SOT23-3]  8.92,29.57 180 top
Q14  600mA/40V  [SOT23-3]  5.59,30.23 0 top
Q15  600mA/40V  [SOT23-3]  2.29,31.65 90 top
Q16  MOSFET-PCHANNEL  [SOT23-3]  24.82,123.65 90 top
Q17  600mA/40V  [SOT23-3]  23.77,126.87 270 top
Q18  600mA/40V  [SOT23-3]  28.75,125.91 270 top
Q19  BS138  [SOT23]  64.57,28.12 270 top
Q20  BS138  [SOT23]  64.57,24.94 270 top
Q21  MOSFET-PCHANNEL  [SOT23-3]  70.48,139.19 90 top
Q22  600mA/40V  [SOT23-3]  72.42,132.31 270 top
Q23  600mA/40V  [SOT23-3]  74.19,137.29 90 top
Q24  MOSFET-PCHANNEL  [SOT23-3]  79.91,139.88 270 top
Q25  600mA/40V  [SOT23-3]  77.39,144.2 0 top
Q26  600mA/40V  [SOT23-3]  74.68,140.82 270 top
Q27  600mA/40V  [SOT23-3]  64.87,145.31 0 top
Q28  600mA/40V  [SOT23-3]  61.37,144.53 180 top
R1  10K  [DISCRETE_R0603]  48.97,73.46 0 top
R2  0R  [R0603]  22.17,107.34 90 top
R3  0R  [DISCRETE_R0603]  61.44,96.82 180 top
R4  51K  [DISCRETE_R0603]  41.58,21.29 0 top
R5  NC  [DISCRETE_R0603]  34.87,18.97 90 top
R6  51K  [DISCRETE_R0603]  33.3,18.97 90 top
R7  51K  [DISCRETE_R0603]  41.58,18.21 0 top
R8  51K  [DISCRETE_R0603]  41.58,19.71 0 top
R9  51K  [DISCRETE_R0603]  31.78,18.97 90 top
R10  51K  [DISCRETE_R0603]  56.18,98.96 180 top
R11  220R  [DISCRETE_R0603]  55.42,102.82 270 top
R12  5.1K  [DISCRETE_R0603]  18.16,121.49 180 top
R13  5.1K  [DISCRETE_R0603]  18.26,124.31 180 top
R14  5.1K  [DISCRETE_R0603]  42.7,148.59 90 top
R15  5.1K  [DISCRETE_R0603]  47.35,148.59 90 top
R16  10K  [R0603]  14.68,115.01 90 top
R17  0R  [R0603]  23.7,107.34 90 top
R18  220R  [DISCRETE_R0603]  52.93,104.37 180 top
R19  1.2K  [DISCRETE_R0603]  31.75,114.43 180 top
R20  33R  [R0603]  44.2,148.59 270 top
R21  33R  [R0603]  45.75,148.59 270 top
R22  10K  [R0603]  19.13,107.34 90 top
R23  50R  [DISCRETE_R0603]  60.45,134.62 0 top
R24  51K  [DISCRETE_R0603]  52.93,102.77 0 top
R25  10K  [R0603]  18.24,110.92 90 top
R26  10K  [R0603]  16.42,110.97 270 top
R27  5.1K  [DISCRETE_R0603]  10.06,40.56 180 top
R28  1.2K  [R0603]  83.9,127.69 180 top
R29  2K  [DISCRETE_R0603]  60.68,99.24 90 top
R30  1K  [DISCRETE_R0603]  62.2,99.24 270 top
R31  NC  [DISCRETE_R0603]  63.4,125.37 90 top
R32  3.6R  [DISCRETE_R0603]  54.53,129.03 90 top
R33  3.6R  [DISCRETE_R0603]  59,129.21 270 top
R34  100R  [R0603]  16.46,51.54 180 top
R35  0R  [R0603]  35.38,120.85 180 top
R36  NC  [DISCRETE_R0603]  35.41,125.5 0 top
R37  NC  [DISCRETE_R0603]  35.41,123.98 0 top
R38  5.1K  [DISCRETE_R0603]  10.06,45.03 180 top
R39  10K  [DISCRETE_R0603]  65.61,129.62 90 top
R40  33R  [R0603]  10.06,42.04 0 top
R41  0R  [R0603]  59.44,19.56 180 top
R42  NC  [DISCRETE_R0603]  35.38,117.74 0 top
R43  499K/NC  [R0603]  49.99,22.02 180 top
R44  10K  [DISCRETE_R0603]  35.38,119.31 0 top
R45  33R  [R0603]  10.06,43.54 0 top
R46  NC  [R0603]  24.66,62.1 0 top
R47  NC  [DISCRETE_R0603]  35.37,116.17 0 top
R48  3.3K  [R0603]  67.13,26.95 270 top
R49  22K  [DISCRETE_R0603]  60.68,105.51 270 top
R50  3.3K  [DISCRETE_R0603]  61.44,107.98 180 top
R51  5.1K  [DISCRETE_R0603]  8.86,21.39 180 top
R52  0K  [DISCRETE_R0603]  60.68,110.31 90 top
R53  5.1K  [DISCRETE_R0603]  8.81,23.75 180 top
R54  33R  [R0603]  5.33,14.91 0 top
R55  51K  [DISCRETE_R0603]  30.07,19 270 top
R56  0R  [R0603]  59.05,61.04 270 top
R57  51K  [DISCRETE_R0603]  78.71,47.5 180 top
R58  10K  [DISCRETE_R0603]  62.33,147.78 270 top
R59  4.7K  [DISCRETE_R0603]  56.41,125.96 270 top
R60  10K  [DISCRETE_R0603]  57.99,125.96 90 top
R61  1.2K  [R0603]  76.56,130.45 90 top
R62  1.2K  [R0603]  74.93,130.45 90 top
R63  0R  [R0603]  36.93,127.18 180 top
R64  10K  [DISCRETE_R0603]  64.9,113.44 90 top
R65  33R  [R0603]  5.33,16.46 0 top
R66  10K  [R0603]  83.87,57.18 0 top
R67  100K  [R0603]  87.35,60.22 180 top
R68  0R  [R0603]  83.95,55.42 180 top
R69  10K  [DISCRETE_R0603]  34.8,25.48 90 top
R70  10K  [DISCRETE_R0603]  36.35,23.95 90 top
R71  33R  [R0603]  37.9,25.48 270 top
R72  5.1K  [DISCRETE_R0603]  54.79,148.54 90 top
R73  5.1K  [DISCRETE_R0603]  59.28,148.54 90 top
R74  0R  [R0603]  61.57,38.3 180 top
R75  0R  [R0603]  61.72,39.78 180 top
R76  0R  [R0603]  62.26,41.25 180 top
R77  0R  [R0603]  63.17,42.7 180 top
R78  0R  [R0603]  63.22,44.15 180 top
R79  0R  [R0603]  78.71,42.95 180 top
R80  0R  [R0603]  78.71,38.51 180 top
R81  0R  [R0603]  79.78,36.17 270 top
R82  0R  [R0603]  84.23,36.2 270 top
R83  0R  [R0603]  78.71,44.45 180 top
R84  0R  [R0603]  78.71,49.12 180 top
R85  33R  [R0603]  56.31,148.54 270 top
R86  33R  [R0603]  57.81,148.54 270 top
R87  1.5K  [R0603]  13.69,35.31 180 top
R88  1.5K/NC  [R0603]  13.69,36.78 180 top
R89  0R  [R0603]  58.09,49.53 180 top
R90  0R  [R0603]  58.09,51 180 top
R91  0R  [R0603]  58.12,52.45 180 top
R92  0R  [R0603]  54.97,54.99 180 top
R93  0R  [R0603]  54.99,56.54 180 top
R94  0R  [R0603]  54.99,58.09 180 top
R95  4.02K  [R0603]  51.89,53.01 90 top
R96  0R  [R0603]  48.97,79.71 0 top
R97  0R  [R0603]  48.95,78.23 0 top
R98  0R  [R0603]  49,81.18 0 top
R99  0R  [R0603]  49.02,82.65 0 top
R100  0R  [R0603]  48.95,76.76 0 top
R101  33R  [R0603]  12.37,46.79 270 top
R102  0R  [R0603]  38.76,49.07 90 top
R103  100R  [R0603]  16.46,53.06 180 top
R104  100R  [R0603]  16.46,54.56 180 top
R105  100R  [R0603]  16.46,56.08 180 top
R106  100R  [R0603]  16.46,59.08 180 top
R107  100R  [R0603]  16.46,57.58 180 top
R108  10K  [DISCRETE_R0603]  65.86,60.27 0 top
R109  0R  [R0603]  48.95,75.29 0 top
R110  33R  [R0603]  13.84,46.76 270 top
R111  33R  [R0603]  8.33,16.46 180 top
R112  33R  [R0603]  8.36,14.91 180 top
R113  5.1K  [R0603]  25.83,34.06 180 top
R114  NC/5.1K  [R0603]  25.83,32.56 0 top
R115  NC/5.1K  [R0603]  13.64,41.33 0 top
R116  5.1K  [R0603]  15.14,42.95 0 top
R117  NC/5.1K  [R0603]  13.69,39.83 0 top
R118  5.1K  [R0603]  13.69,38.28 180 top
R119  NC/5.1K  [R0603]  24.49,39.73 270 top
R120  5.1K  [R0603]  22.99,39.73 90 top
R121  6.19K  [R0603]  14.58,32.36 0 top
R122  5.1K  [R0603]  18.92,42.9 270 top
R123  5.1K  [R0603]  21.92,42.88 90 top
R124  0R  [R0603]  39.4,32.16 270 top
R125  0R  [R0603]  40.87,32.16 270 top
R126  0R  [R0603]  42.34,32.16 270 top
R127  0R  [R0603]  43.81,32.18 270 top
R128  0R  [R0603]  45.26,32.18 270 top
R129  0R  [R0603]  40.87,23.57 270 top
R130  NC/5.1K  [R0603]  13.69,33.83 180 top
R131  NC/10K  [R0603]  23.52,30.25 90 top
R132  NC/10K  [R0603]  22.76,32.51 180 top
R133  0R  [R0603]  79.1,26.7 0 top
R134  0R  [R0603]  84.91,18.11 90 top
R135  0R  [R0603]  86.44,18.08 90 top
R136  0R  [R0603]  75.49,16.26 0 top
R137  0R  [R0603]  79.93,19.41 270 top
R138  10K/NC  [R0603]  71.86,18.75 90 top
R139  10K  [R0603]  73.43,18.75 270 top
R140  200R  [R0603]  91.82,22.25 0 top
R141  10R  [R0603]  63.32,14.86 180 top
R142  0R/NC  [R0603]  58.57,33.2 180 top
R143  10K  [R0603]  73.76,31.42 90 top
R144  0R  [R0603]  16.36,60.78 0 top
R145  100K  [R0603]  68.07,33.4 90 top
R146  22.1K  [R0603]  67.31,31.11 0 top
R147  0R  [R0603]  23.9,64.82 270 top
R148  2.2K  [R0603]  60.91,27.3 180 top
R149  NC  [DISCRETE_R0603]  22.2,61.34 270 top
R150  4.02K  [R0603]  45.95,50.57 90 top
R151  10K  [R0603]  24.66,60.58 180 top
R152  2.2K  [R0603]  95.71,19.89 90 top
R153  0R  [R0603]  59.46,34.77 0 top
R154  0R  [R0603]  59.49,36.27 0 top
R155  0R  [R0603]  68.25,40.84 180 top
R156  10K  [DISCRETE_R0603]  29.39,110.01 90 top
R157  10K  [DISCRETE_R0603]  49,70.36 180 top
R158  10K  [DISCRETE_R0603]  50.67,87.2 0 top
R159  10K  [DISCRETE_R0603]  48.31,84.91 90 top
R160  NC  [DISCRETE_R0603]  50.67,85.67 0 top
R161  NC  [DISCRETE_R0603]  48.36,87.96 270 top
R162  2.2K  [R0603]  94.13,19.89 90 top
R163  0R  [R0603]  91.85,19.13 0 top
R164  10K  [R0603]  84.91,24.46 90 top
R165  150K  [R0603]  87.96,24.49 90 top
R166  150K  [R0603]  89.43,24.56 90 top
R167  0R  [R0603]  90.78,27.84 0 top
R168  0R  [R0603]  90.78,32.44 0 top
R169  499K/NC  [R0603]  57.43,21.44 180 top
R170  0R  [R0603]  83.41,24.46 90 top
R171  0R  [R0603]  83.11,59.51 270 top
R172  10K  [DISCRETE_R0603]  52.96,143.03 180 top
R173  51K  [DISCRETE_R0603]  47.24,143 0 top
R174  10K  [DISCRETE_R0603]  1.5,35.26 90 top
R175  51K  [DISCRETE_R0603]  6.27,34.24 90 top
R176  10K  [DISCRETE_R0603]  2.51,29.24 0 top
R177  51K  [DISCRETE_R0603]  11.28,29.79 90 top
R178  1.5K  [R0603]  13.72,29.84 270 top
R179  1.5K  [R0603]  20.42,42.88 270 top
R180  10K  [DISCRETE_R0603]  26.29,127.64 270 top
R181  51K  [DISCRETE_R0603]  27.43,121.97 90 top
R182  3.3K  [R0603]  67.13,23.67 90 top
R183  2.2K  [R0603]  60.91,24.1 180 top
R184  0R  [R0603]  64.16,119.13 180 top
R185  0R  [R0603]  34.67,103.53 270 top
R186  51K  [DISCRETE_R0603]  78.71,45.97 180 top
R187  51K  [DISCRETE_R0603]  78.71,41.5 180 top
R188  51K  [DISCRETE_R0603]  78.71,40.01 180 top
R189  51K  [DISCRETE_R0603]  81.25,36.17 270 top
R190  51K  [DISCRETE_R0603]  82.75,36.2 270 top
R191  10K  [DISCRETE_R0603]  74.42,134.77 0 top
R192  51K  [DISCRETE_R0603]  71.5,135.79 90 top
R193  10K  [DISCRETE_R0603]  72.92,143.18 0 top
R194  51K  [DISCRETE_R0603]  77.32,140.44 90 top
R195  51K  [DISCRETE_R0603]  63.5,142.14 90 top
R196  NC  [R0603]  56.06,16.28 0 top
R197  2.2K  [R0603]  60.91,28.78 180 top
R198  2.2K  [R0603]  60.88,25.6 180 top
RST  TS24CA  [2*4*3.5MM]  3.12,114.01 90 top
SD  [9P-SMD-W/-RING]  35.9,15.11 270 top
SPK  1X2P  [1X2P-SMT1.25MM]  95,30.18 90 top
U1  ESP32-C6-MINI-1  [ESP32-C6-MINI-1]  88.98,46.2 270 top
U2  RY3730  [SOT23-6]  62.1,129.41 0 top
U3  CH340K  [ESOP-10-EP-150MIL]  22.02,113.44 270 top
U4  SGM6601YTN5G/TR  [SOT-23-5]  61.98,113.44 270 top
U5  SPX3819  [SOT23-5]  64.29,121.97 90 top
U6  TP4056  [SOP8-1.27P]  81.58,131.85 180 top
U7  AMS1117-3.3V  [SOT89]  68.83,117.25 180 top
U8  ESP32-P4  [QFN105-35P-500L500W]  49.45,41.94 180 top
U9  W25Q128JV  [SOIC-8-208MIL]  61.59,56.18 180 top
U10  SPX3819  [SOT23-5]  79.07,29.67 180 top
U11  TLV62569DBVR  [SOT23-5-95P-300L300W]  70.87,31.7 180 top
U12  ES8311  [QFN20-40P-300L300W55H]  74.55,23.34 90 top
U13  IP101GRI  [QFN32-40P-400W400L]  18.9,37.47 180 top
U14  SPX3819  [SOT23-5]  39.09,107.62 180 top
U15  SPX3819  [SOT23-5]  35.56,107.62 180 top
U16  SPX3819  [SOT23-5]  31.98,107.62 180 top
U17  TLV62569DBVR  [SOT23-5-95P-300L300W]  55.37,18.85 0 top
U20  NS4150B  [MSOP8-65P-490L300W110H]  87.4,29.59 90 top
U$1  [MAKERFABS_0.3]  69.46,81.25 90 top
UN  [TP_4545]  81.86,48.31 270 top
UP  [TP_4545]  81.92,46.38 270 top
USB-CDC/JTAG  [USB-C-16P-5]  6.86,42.57 270 top
USB-DEVICE  [USB-C-16P-5]  57.09,157.55 180 top
USB-NATIVE  [USB-C-16P-5]  44.97,157.6 180 top
USB-OTG  [USB-C-16P-5]  6.86,22.78 270 top
USB-TTL  [USB-C-16P-5]  7.07,123.07 270 top
VCOM  [TP_4545]  60.68,90.5 270 top
VGH  [TP_4545]  53.67,94.23 180 top
VGL  [TP_4545]  55.42,92.05 270 top
VPWR  [TP_4545]  67.31,130.38 180 top
X1  40MHz(10ppm)  [NX3225]  52.55,28.68 90 top
X2  25MHz(10ppm)  [NX3225]  25.63,36.35 180 top
X3  24MHz  [OSC4-SMD-2.5X2.0X0.8MM]  19.63,61.34 180 top

## Tracks (layer width: path | path; a pad name or v marks a point on that pad's centre or on a via)
3.3V  (via drill 0.3)
  Top 0.178: 82.73,35.41 R190.2
  Top 0.305: R42.2 R47.2
  Top 0.406: R36.2 R63.2 C29.2 36.18,130.16 C23.2 36.17,132.06 | v41.43,119.3 v41.42,119.31 R44.2 R42.2 | 36.17,132.06 36.17,138.41 38.3,140.54 38.3,152.2 37.31,153.19 37,153.5 P3.1 | v41.43,132.08 36.73,132.08 | 36.73,132.08 36.2,132.08 36.17,132.06 | 36.17,132.64 36.73,132.08 | 36.73,132.08 36.2,131.55
  Top 0.61: 82.73,35.41 v82.02,35.41 R189.2 | 77.95,40.18 v77.95,40.87 | R186.2 v77.95,46.48 | R187.2 v77.95,40.87 | v77.95,46.48 R57.2 | v50.6,73.46 R1.2 | R155.1 C24.2 C16.2 C17.2 74.97,40.84 C30.2 75,40.87 77.27,40.87 | v53.77,67.21 67.79,67.21 74.4,60.6 74.4,50.04 v77.95,46.48 | 77.27,40.87 v77.95,40.87 | U1.3 91.38,53.17 90.93,53.62 90.02,53.62 89.1,54.53 86.87,54.53 86.61,54.79 C9.1 v86.61,56.44 C5.1 | R188.2 77.95,40.18 | 77.95,40.18 77.27,40.87 | 77.27,40.87 77.93,41.53 | R66.2 C5.1 | C5.1 86.61,58.7 C22.1 86.6,60.21 R67.2
  Bottom 0.61: P1.1 97.16,34.37 85.72,34.37 84.68,35.41 v82.02,35.41 80.06,35.41 77.95,37.52 v77.95,40.87 v77.95,46.48 77.95,47.78 v86.61,56.44 | 53.19,67.21 45.87,67.21 41.43,71.65 v41.43,119.3 v41.43,132.08 | 53.19,67.21 v53.77,67.21 53.77,67.79 | v50.6,73.46 53.77,70.28 53.77,67.79 | 53.19,67.21 53.77,67.79
25M_XI
  Top 0.178: U13.2 21.98,36.47 22.63,35.81 23.2,35.81 C117.2 24.25,35.83 X2.3
25M_XO
  Top 0.178: U13.3 22.31,36.87 23.52,38.08 26.07,38.08 | 26.07,38.08 C116.1 26.73,38 X2.1 | 26.07,38.08 26.59,38.08 26.72,37.95 26.72,37.54
+3V3  (via drill 0.3)
  Top 0.203: U14.1 40.04,110.68 C159.2 | C159.2 C20.1 | C20.1 C25.1 | C25.1 C60.2 | C60.2 C27.1 | C27.1 C66.2 R156.2 | U16.1 32.93,110.7 C27.1 | U15.3 34.61,110.68 C60.2 | U15.1 C25.1 | U14.3 38.14,110.53 C20.1 | v38.84,111.05 40.24,111.05 C159.2
  Top 0.305: U3.10 C3.2 C18.2 | 22.19,60.57 R149.2
  Top 0.406: v29.52,50.67 v29.52,33.96 | R48.2 R182.2 66.65,23.95 v66.45,23.95 | v29.52,59.03 25.45,59.03 R151.2 R149.2 | 22.19,60.57 X3.4 X3.1 | R22.2 C19.2 21.02,108.45 v21.02,109.75 U3.7 | C42.1 61.16,120.14 60.83,119.81 53.7,119.81 46.28,127.23 v38.84,127.23 37.74,127.23 R63.1 | v66.45,21.92 66.45,16.1 v68.17,14.38 71.73,10.82 71.73,9.12
  Top 0.61: C18.2 27.74,110.77 R156.2 29.39,112.3 PWR.A | U5.5 61.18,121.02 C42.1 | J1.3 71.73,9.12 71.73,7.34 72.54,6.53 83.46,6.53 84.3,7.37 84.3,9.64 J2.3
  Bottom 0.203: v38.84,127.23 v38.84,111.05
  Bottom 0.406: v29.52,50.67 v29.52,59.03 29.52,106.17 v24.94,110.74 22.01,110.74 v21.02,109.75 | v29.52,33.96 29.52,32.16 31.75,29.92 38.05,29.92 38.58,29.39 49.02,29.39 51.84,26.57 51.84,22.2 59.66,14.38 v68.17,14.38 | v66.45,23.95 v66.45,21.92
  pour Top: 23.75,110.01 32.38,110.01 32.64,109.75 32.64,108.33 34.9,108.33 34.9,109.7 35.1,109.91 35.99,109.91 36.17,109.73 36.17,108.31 38.46,108.31 38.46,109.73 38.66,109.93 39.52,109.93 39.73,109.73 39.73,108.33 40.46,108.33 40.46,110.82 40.21,111.07 39.27,111.07 38.84,111.51 23.75,111.51
A3V3  (via drill 0.3)
  Top 0.178: 80.02,26.86 80.01,26.86 80.01,26.98
  Top 0.406: R133.2 80.02,26.86 80.02,27.64 | 80.02,27.64 U10.5 | C139.2 81.61,27.64 | 81.61,27.64 80.02,27.64 | 81.61,27.64 81.66,27.69 v81.66,28.52 C137.1 | v69.67,43.16 69.67,46.2 v70.66,47.19 | v75.36,53.8 75.36,60.94 v70.46,65.84 | v77.8,77.55 77.8,104.1 FB3.2 | 80.01,26.98 80.54,27.51 81.53,27.51
  Bottom 0.406: v81.66,28.52 76.61,33.58 70.94,33.58 69.67,34.85 v69.67,43.16 | v70.66,47.19 75.36,51.89 v75.36,53.8 | v70.46,65.84 77.8,73.18 v77.8,77.55
ADCVREF  (via drill 0.3)
  Top 0.203: U12.15 73.75,25.57 v72.47,26.85 C126.2 | v90.47,22.25 R140.1
  Bottom 0.203: v72.47,26.85 73.36,27.74 77.57,27.74 83.06,22.25 v90.47,22.25
AGND  (via drill 0.3)
  Top 0.178: 79.81,24.31 79.81,24.28 79.77,24.24
  Top 0.203: 74.91,17.98 C118.2 74.4,18.01 | 75.74,21.84 U12.5 75.35,22.39 74.55,23.19 U12.21 75.06,23.85 75.18,23.85 75.48,24.14 U12.10 76.21,24.31 79.4,24.31 | 84.89,21.95 C146.2 | 79.81,24.31 79.83,24.28 | 91.11,20.68 C135.2 | 79.88,25.07 C121.2 | 79.4,24.31 79.7,24.31 79.77,24.24 79.83,24.18 | R164.1 84.94,23.67 v85.67,23.67 | 79.86,23.85 79.4,24.31 | 79.4,24.31 79.78,24.69
  Top 0.406: R139.2 v74.19,17.98 74.91,17.98 | v91.11,25.96 C161.1 C164.2 93.88,25.27 MIC.2 MIC.3 96.77,24.08 C162.2 C163.2 | C128.2 C126.1 v72.72,28.88 C127.1 | C119.2 C120.2 79.83,24.18 C121.2 | 84.89,21.95 84.84,21.89 C119.2 | C146.2 C144.2 C140.2 R164.1 | C148.2 v90.02,30.07 | v90.02,30.07 C149.1 | v90.02,30.07 89.79,30.3 87.35,30.3 87.08,30.58 U20.7 87.08,32.58 86.82,32.84 86.16,32.84 85.06,31.75 C142.2 C143.2 C141.2 | R137.1 79.83,20.27 | 79.83,20.27 C119.2 | 79.83,20.27 79.73,20.17 C131.2 | C131.2 77.19,21.29 76.15,21.29 75.59,21.84 75.49,21.84 | C131.2 C132.2 78.33,18.64 v78.33,17.98 | R163.1 C135.2 | 91.11,20.68 v91.11,21.34
  Bottom 0.406: v72.72,28.88 78.79,28.88 84.02,23.65 85.65,23.65 | 85.65,23.65 v85.67,23.67 | 85.65,23.65 90.63,23.65 | 90.63,23.65 91.11,23.65 | v91.11,21.34 91.11,23.16 | 91.11,23.16 91.11,23.65 | 91.11,23.65 91.11,24.13 | 91.11,24.13 v91.11,25.96 91.11,28.98 v90.02,30.07 | v74.19,17.98 v78.33,17.98 | 91.11,24.13 90.63,23.65 | 90.63,23.65 91.11,23.16
AVDD
  Top 0.178: 78.23,25.02 78.23,25.04 C121.1
  Top 0.203: U12.11 78.03,24.84 C121.1 | 75.36,25.02 78.23,25.02 78.23,25.2 75.34,25.2
  Top 0.406: C121.1 78.33,25.15 R133.1
BAT
  Top 0.61: R141.1 64.08,16.47 FB2.1
C6_EN  (via drill 0.3)
  Top 0.254: U1.8 87.38,52.81 87.02,53.16 82.14,53.16 | 82.14,53.16 81.89,53.16 81.86,53.14 | 81.86,52.86 C6_EN.T v81.25,49.55 | 81.86,52.86 81.86,53.14 | 81.86,53.14 81.86,53.42 | 81.86,53.42 81.86,55.85 C1.1 81.48,57.2 | 81.48,57.2 81.48,57.86 C6_RST.3 | 81.48,57.2 81.51,57.17 R66.1 R171.2 | 81.86,53.42 81.89,53.42 82.14,53.16 | 82.14,53.16 82.14,53.14 81.86,52.86
  Top 0.406: C6_RST.4 C6_RST.3
  Bottom 0.254: P1.6 85.6,36.32 80.44,36.32 78.92,37.85 78.92,47.22 v81.25,49.55
C6_IO2
  Top 0.254: U1.5 89.78,52.56 88.59,53.75 86.39,53.75 R68.1
C6_U0RXD
  Top 0.254: U1.30 88.98,39.22 90.37,37.82 C6_U0RXD.T P1.4
C6_U0TXD
  Top 0.254: U1.31 89.78,39.41 90.04,39.14 92.3,39.14 C6_U0TXD.T P1.3
CCLK  (via drill 0.3)
  Top 0.178: 59.23,33.3 R142.1 59.33,33.1 v58.83,32.59
  Top 0.203: R144.1 15.57,60.78 15.57,60.71 v13.82,58.95 | v32.05,50.55 v32.05,33.91 | v22.35,57.3 v32.05,57.3
  Top 0.305: C87.2 R142.1 | J4.14 13.04,58.23 R144.1
  Bottom 0.203: v32.05,57.3 v32.05,50.55 | v22.35,57.3 15.67,57.3 14.02,58.95 v13.82,58.95 | v32.05,33.91 32.05,33.15 32.44,32.77 39.5,32.77 40.08,32.18 52.96,32.18 53.44,32.66 58.75,32.66 v58.83,32.59
CODEC_CE  (via drill 0.3)
  Top 0.203: R138.2 v72.62,19.51 | v72.62,19.51 R139.1 73.28,19.66 73.13,19.51 v72.62,19.51 | U12.20 73.05,21.54 v72.62,21.11
  Bottom 0.203: v72.62,21.11 v72.62,19.51
COL
  Top 0.178: U13.4 22.08,37.27 22.99,38.18 R120.1 R119.2
CRS
  Top 0.178: U13.20 15.95,37.66 15.24,38.38 15.24,40.49 R115.2
  Top 0.406: R115.2 R116.1
CSI_1V8  (via drill 0.3)
  Top 0.305: J4.16 7.52,59.23 v7.72,59.03
  Top 0.406: v31.39,50.95 v31.39,34.42 | v22.86,56.64 v31.39,56.64 | R197.2 60.15,28.04 | 60.15,28.04 R148.2 | v58.47,24.71 59.41,24.71 | 59.41,24.71 60.12,24.71 60.15,24.69 | v58.47,28.07 59.49,28.07 | 59.49,28.07 60.12,28.07 60.15,28.04 | v7.72,100.25 35.46,100.25 36.5,101.3 C32.2 C31.1 | R185.1 C31.1 | U15.5 36.51,104.3 C31.1 | R183.2 60.15,24.69 | 60.15,24.69 60.15,25.58 R198.2 | 60.12,25.43 59.41,24.71 | 59.41,24.71 59.99,24.13 | 60.07,24.05 59.99,24.13 | 59.99,24.13 59.99,25.12 | 60.17,27.38 59.49,28.07 | 59.49,28.07 60.17,28.75
  Bottom 0.406: v31.39,56.64 v31.39,50.95 | v22.86,56.64 15.39,56.64 13.92,58.12 8.64,58.12 v7.72,59.03 v7.72,100.25 | v31.39,34.42 31.39,32.84 32.84,31.39 38.81,31.39 39.4,30.81 55.73,30.81 v58.47,28.07 v58.47,24.71
CSI_2V8  (via drill 0.3)
  Top 0.305: J4.23 J4.24
  Top 0.406: U14.5 C21.1 C108.2 40.03,101.98 37.62,99.57 v7.04,99.57 | v6.27,63.75 J4.24
  Bottom 0.406: v7.04,99.57 7.04,64.52 v6.27,63.75
CSI_A_CLKN
  Top 0.305: J4.6 15.37,54.23 R104.2
CSI_A_CLKP
  Top 0.305: J4.7 14.34,54.73 R105.2
CSI_A_DATA0N
  Top 0.305: J4.9 13.85,55.73 R107.2
CSI_A_DATA0P
  Top 0.305: J4.10 12.85,56.23 R106.2
CSI_A_DATA1N
  Top 0.305: J4.3 14.5,52.73 R34.2
CSI_A_DATA1P
  Top 0.305: J4.4 15.53,53.23 R103.2
CSI_REXT
  Top 0.178: U8.48 46.48,49.28 R150.1
CSI_RST
  Top 0.305: R149.1 R46.1 R147.2 22.51,64.06 CSI_RST.4 CSI_RST.3 16.9,64.07 C88.2 12.56,59.73 J4.17
CSI_SCL  (via drill 0.3)
  Top 0.203: v22.35,58.37 v30.18,58.37 | v30.18,50.95 v30.18,34.42 | J4.21 10.93,61.73 12.41,61.73 arc-90 12.42,61.72 v12.42,61.77 | v58.78,23.34 60.91,23.34 R183.1
  Top 0.305: Q20.2 61.78,23.99 R183.1
  Bottom 0.203: v30.18,58.37 v30.18,50.95 | v22.35,58.37 16,58.37 12.64,61.73 v12.42,61.77 12.41,61.73 | v30.18,34.42 30.18,32.33 32.03,30.48 38.28,30.48 38.86,29.9 55.24,29.9 57.25,27.89 57.25,24.87 v58.78,23.34
CSI_SDA  (via drill 0.3)
  Top 0.203: v22.86,57.84 v30.73,57.84 | v30.73,50.55 v30.73,33.91 | R148.1 60.83,26.47 v57.84,26.47 | J4.20 6.32,61.19 7.32,61.19 11.4,61.19 arc-90 v11.43,61.14
  Top 0.305: R148.1 63.41,27.3 Q19.2
  Bottom 0.203: v30.73,57.84 v30.73,50.55 | v22.86,57.84 15.8,57.84 12.75,60.88 12.45,61.19 11.43,61.19 v11.43,61.14 | v30.73,33.91 30.73,32.61 32.46,30.89 38.51,30.89 39.09,30.3 55.5,30.3 57.84,27.96 v57.84,26.47
D+
  Top 0.305: USB-TTL.B6 5.68,122.31 5.21,121.84 4.55,121.84 4.24,122.15 4.24,122.89 4.67,123.31 USB-TTL.A6 20.32,123.31 24.02,119.61 U3.1
D-  (via drill 0.3)
  Top 0.305: USB-TTL.B7 5.14,123.81 v4.9,124.05 | v4.9,122.58 5.14,122.81 USB-TTL.A7 19.83,122.81 23.02,119.62 U3.2
  Bottom 0.305: v4.9,124.05 v4.9,122.58
DACVREF
  Top 0.203: U12.14 74.15,26.64 C127.2
DSI_A_CLKN
  Top 0.305: J5.13 46.06,79 R98.1
DSI_A_CLKP
  Top 0.305: J5.14 45.11,79.5 R99.1
DSI_A_DATA0N
  Top 0.305: J5.7 47.47,76 R109.1
DSI_A_DATA0P
  Top 0.305: J5.8 47.92,76.5 R100.1
DSI_A_DATA1N
  Top 0.305: J5.10 47.45,77.5 R97.1
DSI_A_DATA1P
  Top 0.305: J5.11 46.5,78 R96.1
DSI_REXT
  Top 0.178: U8.34 51.38,51.73 R95.1
DTR  (via drill 0.3)
  Top 0.178: 15.56,109.35 15.58,109.35 v15.85,109.63
  Top 0.406: Q3.2 15.56,109.35 R26.2 | U3.4 v21.02,117.21 v21.03,117.22
  Bottom 0.406: v15.85,109.63 15.85,112.04 v21.03,117.22
EN_DCDC  (via drill 0.3)
  Top 0.178: U8.79 43.91,35.84 40.92,35.84 38.46,33.38 38.46,30.1 v37.59,29.23
  Top 0.305: R196.1 v55.3,16.97 | v53.21,19.79 53.22,19.8 U17.1
  Bottom 0.178: v37.59,29.23 37.95,28.88 48.69,28.88 51.36,26.21 51.36,21.64 v53.21,19.79 55.3,17.7 v55.3,16.97
ESP_EN  (via drill 0.3)
  Top 0.178: U8.103 53.48,36.54 54.51,35.51 v54.51,34.49 | v33.17,91.64 v14.33,91.64 | C8.2 14.68,113
  Top 0.203: v33.17,33.91 v33.17,50.55
  Top 0.305: C8.2 14.68,113.31 | 14.68,113.31 R16.1 | RST.2 4.56,114.25 R16.1 | R16.1 15.04,114.25 16.2,115.42 Q4.3 | v14.33,113.36 14.63,113.36 14.68,113.31
  Bottom 0.178: v33.17,50.55 v33.17,91.64 | v14.33,91.64 v14.33,113.36
  Bottom 0.203: v33.17,33.91 33.5,33.58 39.98,33.58 40.56,32.99 52.45,32.99 53.95,34.49 v54.51,34.49
FB_DCDC  (via drill 0.3)
  Top 0.178: v36.98,28.85 36.98,29.49 38.1,30.61 38.1,33.55 40.77,36.22 42.95,36.22 44.29,37.56 U8.78
  Top 0.61: R43.1 50.75,22.28 | 50.75,22.28 v50.75,22.78 | v50.75,22.78 C151.2 | U17.5 R169.2 55.32,22.78 51.26,22.78 | v50.75,22.78 51.26,22.78 | 50.7,23.34 51.26,22.78 | 51.26,22.78 50.75,22.28
  Bottom 0.178: v50.75,22.78 50.75,26.21 48.46,28.5 37.34,28.5 v36.98,28.85
FLASH_CK_A
  Top 0.406: U9.6 56.03,56.82 R93.1
FLASH_CS_A
  Top 0.406: R89.1 59.59,49.53 64.34,54.28 U9.1 66.98,54.28 67.26,54.56 67.26,59.64 R108.2
FLASH_D_A
  Top 0.406: U9.5 R94.1
FLASH_HD_A
  Top 0.406: U9.7 56.29,55.55 R92.1
FLASH_Q_A
  Top 0.406: R90.1 59.87,51 64.41,55.55 U9.2
FLASH_WP_A
  Top 0.406: R91.1 60.17,52.45 64.54,56.82 U9.3
GND  (via drill 0.3)
  Top 0.178: C110.2 v18.11,43.66 | X2.2 24.83,37.15 | 26.43,35.55 X2.4
  Top 0.254: C106.2 60.1,37.39 61.39,37.39 62.18,36.6 62.18,34.47
  Top 0.305: J4.25 4.02,62.23 | 4.02,62.23 4.02,60.68 | 4.02,60.68 4.02,58.7 | 4.02,58.7 4.02,57.63 | 4.02,57.63 4.02,55.17 | 4.02,55.17 4.02,53.67 | 4.02,53.67 J4.26 | J4.22 4.02,62.23 | 4.02,62.23 | J4.19 4.07,60.73 4.02,60.68 | J4.15 4.05,58.73 4.02,58.7 | J4.13 4.12,57.73 4.02,57.63 | J4.8 4.08,55.23 4.02,55.17 | J4.5 4.08,53.73 4.02,53.67 | J5.21 40.53,83 39.62,82.09 39.62,81.23 | 39.62,81.23 39.62,80.01 | 39.62,80.01 39.62,78.56 | 39.62,78.56 39.62,77.09 | 39.62,77.09 39.62,76.78 40.92,75.49 40.93,75.5 J5.6 | J5.12 39.69,78.5 39.62,78.56 | J5.9 39.71,77 39.62,77.09 | J5.15 39.63,80 39.62,80.01 | J5.18 39.9,81.5 39.62,81.23 | 24.83,37.15 26.43,35.55
  other vias: 1.78,16.08 18.8,38.48 19.89,37.67 19.51,38.38 1.55,42.88 4.57,44.17 8,17.86 1.32,44.96 19.91,36.88 28.24,34.39 28.47,35.46 30.1,24.82 28.65,25.4 5.13,41.1 3.2,25.55 1.5,24.05 1.8,2.06 24.03,43.59 18.11,36.6 20.6,48.67 19.15,49.83 9.02,49.43 18.08,37.67 19.28,36.55 3.68,27.41 1.78,21.01 2.34,61.37 2.06,55.68 1.73,52.93 9.98,64.92 17.14,62.33 20.6,68.94 43.15,57.73 46.86,60.76 52.48,62.79 62.13,58.55 65.02,64.19 48.16,43.1 48.23,40.89 48.18,39.78 48.23,42.16 48.23,44.45 51.89,45.75 51.87,43.1 51.92,40.72 36.3,39.07 36.42,43.59 19.18,37.44 36.3,50.75 28.19,51.08 28.12,49.35 28.22,55.37 22.1,55.42 39.29,56.26 20.8,65.43 50.52,71.86 39.32,80.42 39.17,86.28 39.22,76.78 36.17,84.58 36.32,77.11 31.14,86.18 30.99,77.8 27.86,85.7 27.71,77.14 20.14,82.75 12.17,87.25 10.31,71.78 19.79,77.01 13.79,80.26 67.84,95.89 67.34,83.21 61.49,77.27 73.53,71.96 93.88,72.11 94.87,56.31 89.74,56.44 85.29,62.53 77.04,53.26 77.44,52.35 85.72,47.22 85.88,44.37 90.88,41.73 92.2,46.2 92.3,49 92.48,41.91 90.04,47.17 89.94,45.19 82.96,40.44 95.28,38.23 97.76,38 93.55,32.79 97.74,30.73 93.7,27.13 84.68,29.57 84.73,26.75 72.75,42.49 73.61,47.96 76.28,50.75 65.91,41.94 65.28,38.73 55.85,25.81 53.87,25.5 53.37,28.93 60.99,30.48 34.34,9.7 39.65,9.83 45.06,18.49 46.69,12.95 55.24,1.6 70.21,4.14 73.69,4.78 83.03,4.72 88.04,4.85 96.75,10.21 92.99,11.28 88.95,14.05 97.84,29.03 72.52,134.92 77.19,136.02 81.97,137.13 81.99,135.46 82.3,132.99 82.35,132.16 82.37,131.29 82.37,130.45 81.81,130.89 81.92,131.72 81.86,132.72 81.18,133.05 81.13,132.26 81.18,131.32 81.25,130.43 80.64,130.84 80.59,131.78 80.62,132.72 81.94,127.1 88.11,133.3 88.72,128.14 87.71,149.5 84.71,162.94 91.36,157.02 85.04,151.1 73.56,151 71.83,156.49 75.87,148.13 63.58,154.97 62.48,151.84 51.36,155.24 52.78,150.32 59.08,161.26 55.83,161.62 47.29,161.16 43.41,161.7 24.31,159 33.15,160.45 28.8,162.03 12.04,151.18 12.29,144.63 18.49,138.07 28.73,141.48 29.44,131.6 28.45,118.34 10.29,110.26 9.17,118.62 23.29,114.22 22.4,114.15 21.54,114.15 20.8,114.05 21.21,113.51 21.97,113.59 22.89,113.67 23.27,113.03 22.4,113 21.54,112.95 20.78,112.95 21.23,112.42 22.12,112.45 23.16,112.42 26.64,114.12 31.04,116.92 35.08,114.15 37.41,123.19 38.66,129.34 45.64,136.25 52.4,136.19 56.62,143 44.4,142.37 37.74,155.22 39.14,144.5 31.22,105.16 38.99,103.48 47.9,105.31 48.18,99.29 48.08,94.92 58.27,103.3 58.29,99.62 58.19,93.88 65.84,107.8 67.39,101.68 51.33,89.56 57.91,82.58 46.61,83.49 16.28,98.09 32.26,95.99 27.91,95.4 27.64,104.06 17.37,103.1 11.2,103.61 5.89,103.56 1.42,98.63 1.83,88.54 1.68,76.86 1.78,71.88 68.15,21.08 79.04,8.99 77.34,8.94 69.62,21.08 81.46,18.57 98.58,17.27 87.27,14.17 66.09,11.84 64.9,18.87 57.53,18.9 58.29,20.62 55.22,21.13 49.53,13.92 55.98,13.94 69.09,29.67 70.84,31.52 70.92,29.97 75.95,29.97 78.99,29.95 77.55,29.79 82.32,30.45 83.95,30.43 75.18,37.19 76.38,46.33 66.22,43.03 57.81,59.46 59.33,58.04 77.29,111.91 82.68,105.26 82.45,96.95 96.47,111.63 85.24,118.21 80.57,122.76 73.66,122.5 69.34,128.98 65.61,126.24 61.82,129.39 59.13,131.04 59.51,139.45 71.78,142.01 71.4,148.06 1.32,5.49 4.45,1.09 37.11,4.55 28.17,19.86 28.37,17.17 24.43,17.55 34.21,22.58 41.07,48.59 42.82,48.67 38.61,51.26 35.61,43.59 35.51,38.18 35.48,39.65 35.74,34.67 82.02,119 85.17,107.52 85.27,100.58 96.04,118.08 89.1,118.19 86.33,125.09 87.05,142.85 62.48,141.38 58.22,144.93 76.4,139.67 20.37,119.41 14.45,117.78 2.16,124.66 2.18,122.1 3.3,120.32 2.97,131.39 9.86,131.57 19.13,131.44 4.04,150.16 5.03,142.47 38.28,134.9 42.98,134.8 52.02,125.63 46.41,123.7 55.12,122.96 45.21,71.2 46.79,69.11 47.62,63.25 57.91,70.76 54.81,83.29 56.97,76.83 44.96,81.69 50.6,6.5 59.49,7.87 78.46,13.74 82.55,13.69 80.85,16.74 11.86,35.26 1.45,40.13 7.98,37.62 0.71,29.11 4.67,42.24 42.32,64.31 35.28,65.23 35.61,62.59 35.43,70.69 27.74,64.41 44.27,82.58 44.25,80.24 55.45,64.8 52.04,64.85 51.89,61.19 46.15,64.06 42.44,62.2 47.68,58.47 55.65,69.16 45.97,117.86 51.38,117.47 46.08,112.6 50.77,112.85 48.56,115.75 23.42,28.52 19.74,32.23 7.21,26.26 1.91,13.18 5.28,11.05 2.79,9.32 14.71,17.98 21.82,18.39 25.37,13.39 16.46,13.61 16.74,5.56 20.7,6.05 19.56,2.26 28.7,30.18 17.35,30.56 14,31.5 11.63,32.21 5.13,33.3 1.35,33.4 5.23,37.01 11.71,40.51 11.84,39.14 13.03,43.1 15.16,45.44 12.52,50.67 17.45,49.66 23.22,50.09 25.65,40.34 25.45,36.98 28.37,38.25 32.33,29.01 30.05,29.36 22.73,29.34 78.13,139.9 70.54,135.05 62.13,136.32 57.51,136.22 1.4,110.82 4.6,112.9 7.11,116.41 12.04,111.84 7.21,108.89 1.73,101.9 5.26,89.74 5.11,96.39 5.41,81.94 5.46,72.87 15.44,72.75 19.86,87.78 11.33,95.25 19.63,59.41 23.24,59.36 21.44,59.36 28.35,60.5 31.47,60.25 30.99,72.09 31.11,65.63 27.94,70.89 22.35,73.71 23.09,85.6 23.01,79.12 40.08,68.38